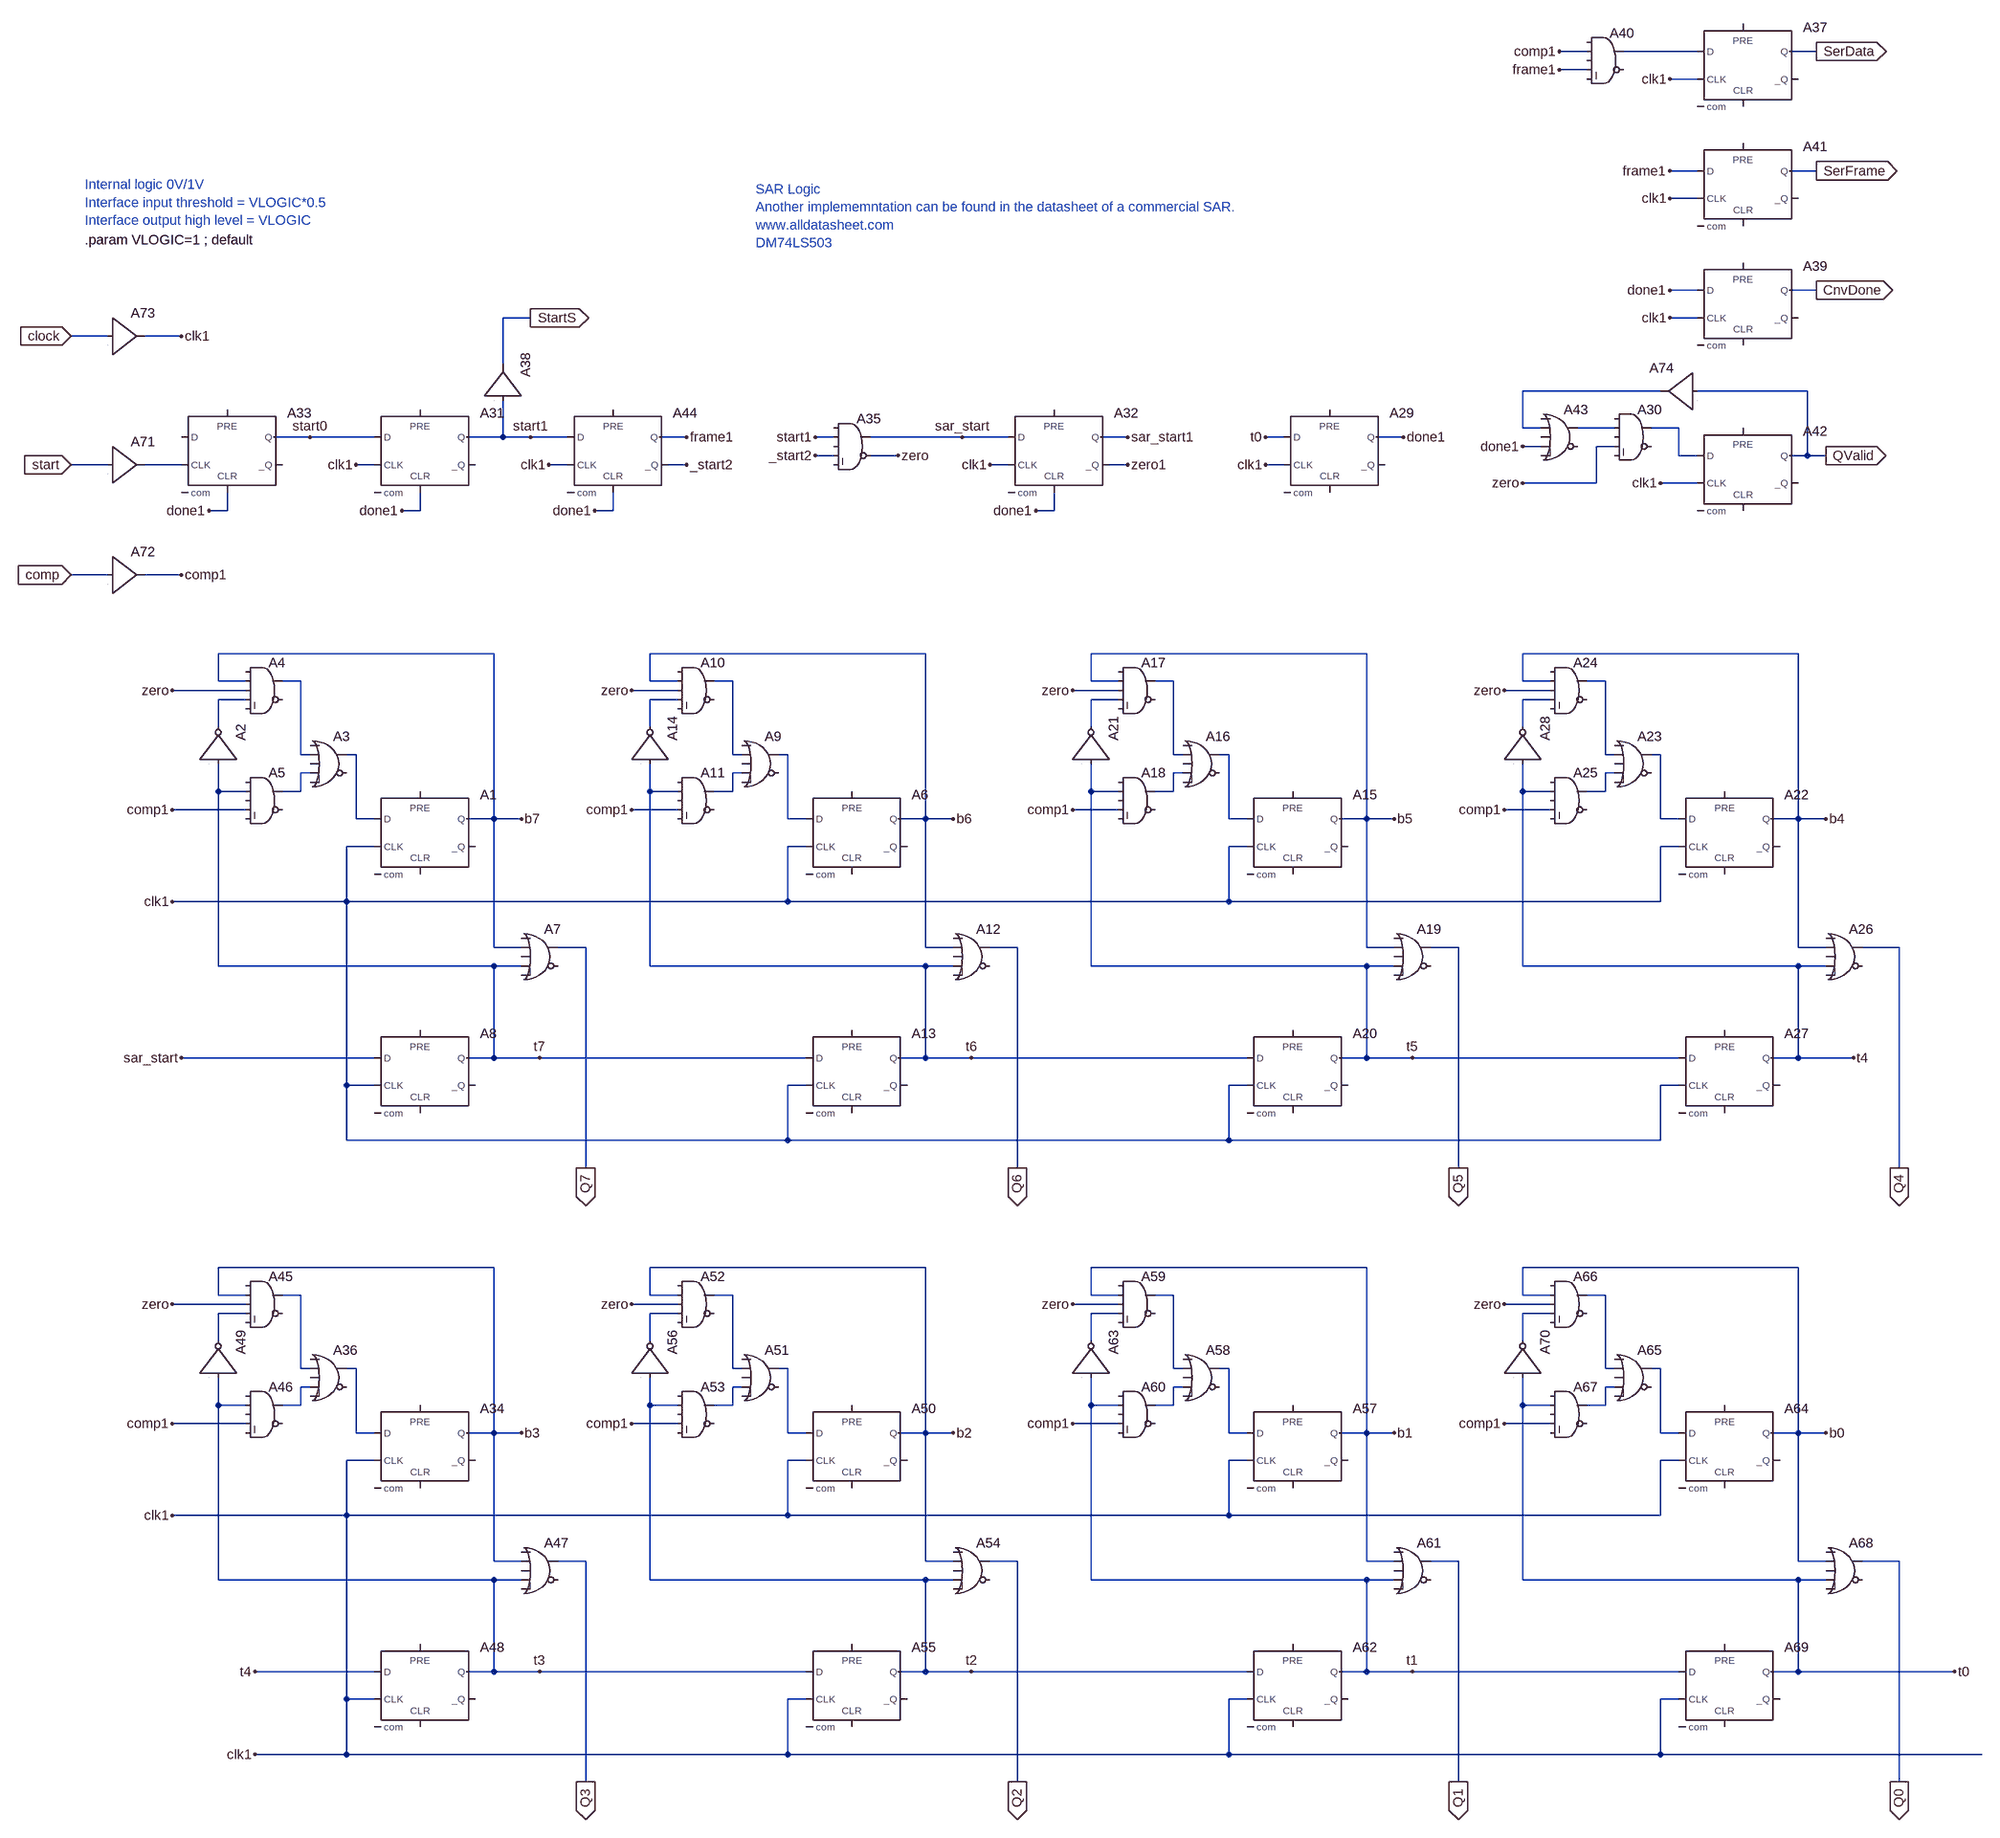
[diagram p0: schematic SAR8bit.asc]
SAR8bit.asc, the LTspice schematic file:
Version 4
SHEET 1 5864 2120
WIRE 1952 -1168 1904 -1168
WIRE 2144 -1168 2016 -1168
WIRE 2352 -1168 2304 -1168
WIRE 1952 -1136 1904 -1136
WIRE 2144 -1120 2096 -1120
WIRE 2144 -960 2096 -960
WIRE 2352 -960 2304 -960
WIRE 2144 -912 2096 -912
WIRE 2144 -752 2096 -752
WIRE 2352 -752 2304 -752
WIRE 112 -704 64 -704
WIRE 2144 -704 2096 -704
WIRE -624 -672 -688 -672
WIRE -496 -672 -560 -672
WIRE 64 -624 64 -704
WIRE 2080 -576 1840 -576
WIRE 2336 -576 2144 -576
WIRE 1840 -512 1840 -576
WIRE 1872 -512 1840 -512
WIRE 2000 -512 1936 -512
WIRE 2112 -512 2064 -512
WIRE -272 -496 -336 -496
WIRE -160 -496 -272 -496
WIRE 64 -496 64 -560
WIRE 64 -496 0 -496
WIRE 112 -496 64 -496
WIRE 176 -496 112 -496
WIRE 384 -496 336 -496
WIRE 640 -496 608 -496
WIRE 864 -496 704 -496
WIRE 944 -496 864 -496
WIRE 1152 -496 1104 -496
WIRE 1424 -496 1392 -496
WIRE 1632 -496 1584 -496
WIRE 1872 -480 1840 -480
WIRE 2000 -480 1968 -480
WIRE 640 -464 608 -464
WIRE 752 -464 704 -464
WIRE 2112 -464 2112 -512
WIRE 2144 -464 2112 -464
WIRE 2336 -464 2336 -576
WIRE 2336 -464 2304 -464
WIRE 2368 -464 2336 -464
WIRE -624 -448 -688 -448
WIRE -496 -448 -560 -448
WIRE -160 -448 -192 -448
WIRE 176 -448 144 -448
WIRE 384 -448 352 -448
WIRE 944 -448 912 -448
WIRE 1152 -448 1120 -448
WIRE 1424 -448 1392 -448
WIRE 1968 -416 1968 -480
WIRE 1968 -416 1840 -416
WIRE 2144 -416 2080 -416
WIRE -416 -368 -416 -400
WIRE -416 -368 -448 -368
WIRE -80 -368 -80 -400
WIRE -80 -368 -112 -368
WIRE 256 -368 256 -400
WIRE 256 -368 224 -368
WIRE 1024 -368 1024 -400
WIRE 1024 -368 992 -368
WIRE -624 -256 -688 -256
WIRE -496 -256 -560 -256
WIRE 48 -64 -432 -64
WIRE 800 -64 320 -64
WIRE 1568 -64 1088 -64
WIRE 2320 -64 1840 -64
WIRE -432 -16 -432 -64
WIRE -384 -16 -432 -16
WIRE -288 -16 -320 -16
WIRE 320 -16 320 -64
WIRE 368 -16 320 -16
WIRE 464 -16 432 -16
WIRE 1088 -16 1088 -64
WIRE 1136 -16 1088 -16
WIRE 1232 -16 1200 -16
WIRE 1840 -16 1840 -64
WIRE 1888 -16 1840 -16
WIRE 1984 -16 1952 -16
WIRE -384 0 -512 0
WIRE 368 0 288 0
WIRE 1136 0 1056 0
WIRE 1888 0 1808 0
WIRE -384 16 -432 16
WIRE 368 16 320 16
WIRE 1136 16 1088 16
WIRE 1888 16 1840 16
WIRE -432 64 -432 16
WIRE 320 64 320 16
WIRE 1088 64 1088 16
WIRE 1840 64 1840 16
WIRE -288 112 -288 -16
WIRE -272 112 -288 112
WIRE -192 112 -208 112
WIRE 464 112 464 -16
WIRE 480 112 464 112
WIRE 560 112 544 112
WIRE 1232 112 1232 -16
WIRE 1248 112 1232 112
WIRE 1328 112 1312 112
WIRE 1984 112 1984 -16
WIRE 2000 112 1984 112
WIRE 2080 112 2064 112
WIRE -272 144 -288 144
WIRE 480 144 464 144
WIRE 1248 144 1232 144
WIRE 2000 144 1984 144
WIRE -432 176 -432 128
WIRE -384 176 -432 176
WIRE -288 176 -288 144
WIRE -288 176 -320 176
WIRE 320 176 320 128
WIRE 368 176 320 176
WIRE 464 176 464 144
WIRE 464 176 432 176
WIRE 1088 176 1088 128
WIRE 1136 176 1088 176
WIRE 1232 176 1232 144
WIRE 1232 176 1200 176
WIRE 1840 176 1840 128
WIRE 1888 176 1840 176
WIRE 1984 176 1984 144
WIRE 1984 176 1952 176
WIRE -384 208 -512 208
WIRE 368 208 288 208
WIRE 1136 208 1056 208
WIRE 1888 208 1808 208
WIRE -192 224 -192 112
WIRE -160 224 -192 224
WIRE 48 224 48 -64
WIRE 48 224 0 224
WIRE 96 224 48 224
WIRE 560 224 560 112
WIRE 592 224 560 224
WIRE 800 224 800 -64
WIRE 800 224 752 224
WIRE 848 224 800 224
WIRE 1328 224 1328 112
WIRE 1360 224 1328 224
WIRE 1568 224 1568 -64
WIRE 1568 224 1520 224
WIRE 1616 224 1568 224
WIRE 2080 224 2080 112
WIRE 2112 224 2080 224
WIRE 2320 224 2320 -64
WIRE 2320 224 2272 224
WIRE 2368 224 2320 224
WIRE -160 272 -208 272
WIRE 592 272 560 272
WIRE 1360 272 1328 272
WIRE 2112 272 2080 272
WIRE -208 368 -208 272
WIRE -208 368 -512 368
WIRE 560 368 560 272
WIRE 560 368 -208 368
WIRE 1328 368 1328 272
WIRE 1328 368 560 368
WIRE 2080 368 2080 272
WIRE 2080 368 1328 368
WIRE 48 448 48 224
WIRE 96 448 48 448
WIRE 208 448 160 448
WIRE 800 448 800 224
WIRE 848 448 800 448
WIRE 960 448 912 448
WIRE 1568 448 1568 224
WIRE 1616 448 1568 448
WIRE 1728 448 1680 448
WIRE 2320 448 2320 224
WIRE 2368 448 2320 448
WIRE 2496 448 2432 448
WIRE -432 480 -432 176
WIRE 48 480 -432 480
WIRE 96 480 48 480
WIRE 320 480 320 176
WIRE 800 480 320 480
WIRE 848 480 800 480
WIRE 1088 480 1088 176
WIRE 1568 480 1088 480
WIRE 1616 480 1568 480
WIRE 1840 480 1840 176
WIRE 2320 480 1840 480
WIRE 2368 480 2320 480
WIRE -160 640 -496 640
WIRE 48 640 48 480
WIRE 48 640 0 640
WIRE 128 640 48 640
WIRE 592 640 128 640
WIRE 800 640 800 480
WIRE 800 640 752 640
WIRE 880 640 800 640
WIRE 1360 640 880 640
WIRE 1568 640 1568 480
WIRE 1568 640 1520 640
WIRE 1648 640 1568 640
WIRE 2112 640 1648 640
WIRE 2320 640 2320 480
WIRE 2320 640 2272 640
WIRE 2416 640 2320 640
WIRE -208 688 -208 368
WIRE -160 688 -208 688
WIRE 592 688 560 688
WIRE 1360 688 1328 688
WIRE 2112 688 2080 688
WIRE -208 784 -208 688
WIRE 560 784 560 688
WIRE 560 784 -208 784
WIRE 1328 784 1328 688
WIRE 1328 784 560 784
WIRE 2080 784 2080 688
WIRE 2080 784 1328 784
WIRE 208 832 208 448
WIRE 960 832 960 448
WIRE 1728 832 1728 448
WIRE 2496 832 2496 448
WIRE 48 1072 -432 1072
WIRE 800 1072 320 1072
WIRE 1568 1072 1088 1072
WIRE 2320 1072 1840 1072
WIRE -432 1120 -432 1072
WIRE -384 1120 -432 1120
WIRE -288 1120 -320 1120
WIRE 320 1120 320 1072
WIRE 368 1120 320 1120
WIRE 464 1120 432 1120
WIRE 1088 1120 1088 1072
WIRE 1136 1120 1088 1120
WIRE 1232 1120 1200 1120
WIRE 1840 1120 1840 1072
WIRE 1888 1120 1840 1120
WIRE 1984 1120 1952 1120
WIRE -384 1136 -512 1136
WIRE 368 1136 288 1136
WIRE 1136 1136 1056 1136
WIRE 1888 1136 1808 1136
WIRE -384 1152 -432 1152
WIRE 368 1152 320 1152
WIRE 1136 1152 1088 1152
WIRE 1888 1152 1840 1152
WIRE -432 1200 -432 1152
WIRE 320 1200 320 1152
WIRE 1088 1200 1088 1152
WIRE 1840 1200 1840 1152
WIRE -288 1248 -288 1120
WIRE -272 1248 -288 1248
WIRE -192 1248 -208 1248
WIRE 464 1248 464 1120
WIRE 480 1248 464 1248
WIRE 560 1248 544 1248
WIRE 1232 1248 1232 1120
WIRE 1248 1248 1232 1248
WIRE 1328 1248 1312 1248
WIRE 1984 1248 1984 1120
WIRE 2000 1248 1984 1248
WIRE 2080 1248 2064 1248
WIRE -272 1280 -288 1280
WIRE 480 1280 464 1280
WIRE 1248 1280 1232 1280
WIRE 2000 1280 1984 1280
WIRE -432 1312 -432 1264
WIRE -384 1312 -432 1312
WIRE -288 1312 -288 1280
WIRE -288 1312 -320 1312
WIRE 320 1312 320 1264
WIRE 368 1312 320 1312
WIRE 464 1312 464 1280
WIRE 464 1312 432 1312
WIRE 1088 1312 1088 1264
WIRE 1136 1312 1088 1312
WIRE 1232 1312 1232 1280
WIRE 1232 1312 1200 1312
WIRE 1840 1312 1840 1264
WIRE 1888 1312 1840 1312
WIRE 1984 1312 1984 1280
WIRE 1984 1312 1952 1312
WIRE -384 1344 -512 1344
WIRE 368 1344 288 1344
WIRE 1136 1344 1056 1344
WIRE 1888 1344 1808 1344
WIRE -192 1360 -192 1248
WIRE -160 1360 -192 1360
WIRE 48 1360 48 1072
WIRE 48 1360 0 1360
WIRE 96 1360 48 1360
WIRE 560 1360 560 1248
WIRE 592 1360 560 1360
WIRE 800 1360 800 1072
WIRE 800 1360 752 1360
WIRE 848 1360 800 1360
WIRE 1328 1360 1328 1248
WIRE 1360 1360 1328 1360
WIRE 1568 1360 1568 1072
WIRE 1568 1360 1520 1360
WIRE 1616 1360 1568 1360
WIRE 2080 1360 2080 1248
WIRE 2112 1360 2080 1360
WIRE 2320 1360 2320 1072
WIRE 2320 1360 2272 1360
WIRE 2368 1360 2320 1360
WIRE -160 1408 -208 1408
WIRE 592 1408 560 1408
WIRE 1360 1408 1328 1408
WIRE 2112 1408 2080 1408
WIRE -208 1504 -208 1408
WIRE -208 1504 -512 1504
WIRE 560 1504 560 1408
WIRE 560 1504 -208 1504
WIRE 1328 1504 1328 1408
WIRE 1328 1504 560 1504
WIRE 2080 1504 2080 1408
WIRE 2080 1504 1328 1504
WIRE 48 1584 48 1360
WIRE 96 1584 48 1584
WIRE 208 1584 160 1584
WIRE 800 1584 800 1360
WIRE 848 1584 800 1584
WIRE 960 1584 912 1584
WIRE 1568 1584 1568 1360
WIRE 1616 1584 1568 1584
WIRE 1728 1584 1680 1584
WIRE 2320 1584 2320 1360
WIRE 2368 1584 2320 1584
WIRE 2496 1584 2432 1584
WIRE -432 1616 -432 1312
WIRE 48 1616 -432 1616
WIRE 96 1616 48 1616
WIRE 320 1616 320 1312
WIRE 800 1616 320 1616
WIRE 848 1616 800 1616
WIRE 1088 1616 1088 1312
WIRE 1568 1616 1088 1616
WIRE 1616 1616 1568 1616
WIRE 1840 1616 1840 1312
WIRE 2320 1616 1840 1616
WIRE 2368 1616 2320 1616
WIRE -160 1776 -368 1776
WIRE 48 1776 48 1616
WIRE 48 1776 0 1776
WIRE 128 1776 48 1776
WIRE 592 1776 128 1776
WIRE 800 1776 800 1616
WIRE 800 1776 752 1776
WIRE 880 1776 800 1776
WIRE 1360 1776 880 1776
WIRE 1568 1776 1568 1616
WIRE 1568 1776 1520 1776
WIRE 1648 1776 1568 1776
WIRE 2112 1776 1648 1776
WIRE 2320 1776 2320 1616
WIRE 2320 1776 2272 1776
WIRE 2592 1776 2320 1776
WIRE -208 1824 -208 1504
WIRE -160 1824 -208 1824
WIRE 592 1824 560 1824
WIRE 1360 1824 1328 1824
WIRE 2112 1824 2080 1824
WIRE -208 1920 -208 1824
WIRE -208 1920 -368 1920
WIRE 560 1920 560 1824
WIRE 560 1920 -208 1920
WIRE 1328 1920 1328 1824
WIRE 1328 1920 560 1920
WIRE 2080 1920 2080 1824
WIRE 2080 1920 1328 1920
WIRE 2640 1920 2080 1920
WIRE 208 1968 208 1584
WIRE 960 1968 960 1584
WIRE 1728 1968 1728 1584
WIRE 2496 1968 2496 1584
FLAG -512 0 zero
FLAG -512 208 comp1
FLAG -496 640 sar_start
FLAG 1056 0 zero
FLAG 1056 208 comp1
FLAG 752 -464 zero
FLAG -512 368 clk1
FLAG -688 -448 start
IOPIN -688 -448 In
FLAG 208 832 Q7
IOPIN 208 832 Out
FLAG 960 832 Q6
IOPIN 960 832 Out
FLAG 1728 832 Q5
IOPIN 1728 832 Out
FLAG 288 208 comp1
FLAG 1808 208 comp1
FLAG 288 0 zero
FLAG 1808 0 zero
FLAG 2496 832 Q4
IOPIN 2496 832 Out
FLAG -448 -368 done1
FLAG 2352 -752 CnvDone
IOPIN 2352 -752 Out
FLAG 1392 -448 clk1
FLAG 1392 -496 t0
FLAG 864 -496 sar_start
FLAG 2352 -1168 SerData
IOPIN 2352 -1168 Out
FLAG 1904 -1168 comp1
FLAG 2096 -1120 clk1
FLAG 1904 -1136 frame1
FLAG 2352 -960 SerFrame
IOPIN 2352 -960 Out
FLAG 2096 -912 clk1
FLAG 2096 -960 frame1
FLAG 1632 -496 done1
FLAG 2096 -704 clk1
FLAG 2080 -416 clk1
FLAG 1840 -480 done1
FLAG 2368 -464 QValid
IOPIN 2368 -464 Out
FLAG 112 -704 StartS
IOPIN 112 -704 Out
FLAG 384 -448 _start2
FLAG 608 -496 start1
FLAG 608 -464 _start2
FLAG 384 -496 frame1
FLAG 1152 -496 sar_start1
FLAG 912 -448 clk1
FLAG 144 -448 clk1
FLAG -192 -448 clk1
FLAG 1152 -448 zero1
FLAG -112 -368 done1
FLAG 224 -368 done1
FLAG 992 -368 done1
FLAG 1840 -416 zero
FLAG 2096 -752 done1
FLAG 96 224 b7
FLAG 848 224 b6
FLAG 1616 224 b5
FLAG 2368 224 b4
FLAG 128 640 t7
FLAG 880 640 t6
FLAG 1648 640 t5
FLAG -512 1136 zero
FLAG -512 1344 comp1
FLAG 1056 1136 zero
FLAG 1056 1344 comp1
FLAG -512 1504 clk1
FLAG 208 1968 Q3
IOPIN 208 1968 Out
FLAG 960 1968 Q2
IOPIN 960 1968 Out
FLAG 1728 1968 Q1
IOPIN 1728 1968 Out
FLAG 288 1344 comp1
FLAG 1808 1344 comp1
FLAG 288 1136 zero
FLAG 1808 1136 zero
FLAG 2496 1968 Q0
IOPIN 2496 1968 Out
FLAG 2592 1776 t0
FLAG 96 1360 b3
FLAG 848 1360 b2
FLAG 1616 1360 b1
FLAG 2368 1360 b0
FLAG 128 1776 t3
FLAG 880 1776 t2
FLAG 1648 1776 t1
FLAG 2416 640 t4
FLAG -368 1776 t4
FLAG -368 1920 clk1
FLAG -272 -496 start0
FLAG 112 -496 start1
FLAG -688 -256 comp
IOPIN -688 -256 In
FLAG -496 -256 comp1
FLAG -688 -672 clock
IOPIN -688 -672 In
FLAG -496 -672 clk1
SYMBOL Digital\\dflop -80 176 R0
SYMATTR InstName A1
SYMATTR Value2 trise=5n td=5n tripdt=1n
SYMBOL Digital\\or -240 64 R0
SYMATTR InstName A3
SYMBOL Digital\\and -352 -64 R0
SYMATTR InstName A4
SYMBOL Digital\\and -352 128 R0
SYMATTR InstName A5
SYMBOL Digital\\or 128 400 R0
SYMATTR InstName A7
SYMATTR SpiceLine Vhigh={VLOGIC} REF=0.5
SYMBOL Digital\\dflop -80 592 R0
SYMATTR InstName A8
SYMATTR Value2 trise=5n td=5n tripdt=1n
SYMBOL Digital\\inv -368 128 M270
SYMATTR InstName A2
SYMBOL Digital\\dflop 672 176 R0
SYMATTR InstName A6
SYMATTR Value2 trise=5n td=5n tripdt=1n
SYMBOL Digital\\or 512 64 R0
SYMATTR InstName A9
SYMBOL Digital\\and 400 -64 R0
SYMATTR InstName A10
SYMBOL Digital\\and 400 128 R0
SYMATTR InstName A11
SYMBOL Digital\\or 880 400 R0
SYMATTR InstName A12
SYMATTR SpiceLine Vhigh={VLOGIC} REF=0.5
SYMBOL Digital\\dflop 672 592 R0
SYMATTR InstName A13
SYMATTR Value2 trise=5n td=5n tripdt=1n
SYMBOL Digital\\inv 384 128 M270
SYMATTR InstName A14
SYMBOL Digital\\dflop 1440 176 R0
SYMATTR InstName A15
SYMATTR Value2 trise=5n td=5n tripdt=1n
SYMBOL Digital\\or 1280 64 R0
SYMATTR InstName A16
SYMBOL Digital\\and 1168 -64 R0
SYMATTR InstName A17
SYMBOL Digital\\and 1168 128 R0
SYMATTR InstName A18
SYMBOL Digital\\or 1648 400 R0
SYMATTR InstName A19
SYMATTR SpiceLine Vhigh={VLOGIC} REF=0.5
SYMBOL Digital\\dflop 1440 592 R0
SYMATTR InstName A20
SYMATTR Value2 trise=5n td=5n tripdt=1n
SYMBOL Digital\\inv 1152 128 M270
SYMATTR InstName A21
SYMBOL Digital\\dflop 2192 176 R0
SYMATTR InstName A22
SYMATTR Value2 trise=5n td=5n tripdt=1n
SYMBOL Digital\\or 2032 64 R0
SYMATTR InstName A23
SYMBOL Digital\\and 1920 -64 R0
SYMATTR InstName A24
SYMBOL Digital\\and 1920 128 R0
SYMATTR InstName A25
SYMBOL Digital\\or 2400 400 R0
SYMATTR InstName A26
SYMATTR SpiceLine Vhigh={VLOGIC} REF=0.5
SYMBOL Digital\\dflop 2192 592 R0
SYMATTR InstName A27
SYMATTR Value2 trise=5n td=5n tripdt=1n
SYMBOL Digital\\inv 1904 128 M270
SYMATTR InstName A28
SYMBOL Digital\\dflop 1504 -544 R0
SYMATTR InstName A29
SYMATTR Value2 trise=5n td=5n tripdt=1n
SYMBOL Digital\\dflop -80 -544 R0
SYMATTR InstName A31
SYMATTR Value2 trise=5n td=5n tripdt=1n
SYMBOL Digital\\dflop -416 -544 R0
SYMATTR InstName A33
SYMATTR Value2 trise=5n td=5n tripdt=1n
SYMBOL Digital\\and 672 -544 R0
SYMATTR InstName A35
SYMBOL Digital\\dflop 2224 -800 R0
SYMATTR InstName A39
SYMATTR Value2 trise=5n td=5n tripdt=1n
SYMATTR SpiceLine Vhigh={VLOGIC} REF=0.5
SYMBOL Digital\\dflop 2224 -1216 R0
SYMATTR InstName A37
SYMATTR Value2 trise=5n td=5n tripdt=1n
SYMATTR SpiceLine Vhigh={VLOGIC} REF=0.5
SYMBOL Digital\\and 1984 -1216 R0
SYMATTR InstName A40
SYMBOL Digital\\dflop 2224 -1008 R0
SYMATTR InstName A41
SYMATTR Value2 trise=5n td=5n tripdt=1n
SYMATTR SpiceLine Vhigh={VLOGIC} REF=0.5
SYMBOL Digital\\dflop 2224 -512 R0
SYMATTR InstName A42
SYMATTR Value2 trise=5n td=5n tripdt=1n
SYMATTR SpiceLine Vhigh={VLOGIC} REF=0.5
SYMBOL Digital\\or 1904 -560 R0
SYMATTR InstName A43
SYMBOL Digital\\dflop 256 -544 R0
SYMATTR InstName A44
SYMATTR Value2 trise=5n td=5n tripdt=1n
SYMBOL Digital\\dflop 1024 -544 R0
SYMATTR InstName A32
SYMATTR Value2 trise=5n td=5n tripdt=1n
SYMBOL Digital\\and 2032 -560 R0
SYMATTR InstName A30
SYMBOL Digital\\dflop -80 1312 R0
SYMATTR InstName A34
SYMATTR Value2 trise=5n td=5n tripdt=1n
SYMBOL Digital\\or -240 1200 R0
SYMATTR InstName A36
SYMBOL Digital\\and -352 1072 R0
SYMATTR InstName A45
SYMBOL Digital\\and -352 1264 R0
SYMATTR InstName A46
SYMBOL Digital\\or 128 1536 R0
SYMATTR InstName A47
SYMATTR SpiceLine Vhigh={VLOGIC} REF=0.5
SYMBOL Digital\\dflop -80 1728 R0
SYMATTR InstName A48
SYMATTR Value2 trise=5n td=5n tripdt=1n
SYMBOL Digital\\inv -368 1264 M270
SYMATTR InstName A49
SYMBOL Digital\\dflop 672 1312 R0
SYMATTR InstName A50
SYMATTR Value2 trise=5n td=5n tripdt=1n
SYMBOL Digital\\or 512 1200 R0
SYMATTR InstName A51
SYMBOL Digital\\and 400 1072 R0
SYMATTR InstName A52
SYMBOL Digital\\and 400 1264 R0
SYMATTR InstName A53
SYMBOL Digital\\or 880 1536 R0
SYMATTR InstName A54
SYMATTR SpiceLine Vhigh={VLOGIC} REF=0.5
SYMBOL Digital\\dflop 672 1728 R0
SYMATTR InstName A55
SYMATTR Value2 trise=5n td=5n tripdt=1n
SYMBOL Digital\\inv 384 1264 M270
SYMATTR InstName A56
SYMBOL Digital\\dflop 1440 1312 R0
SYMATTR InstName A57
SYMATTR Value2 trise=5n td=5n tripdt=1n
SYMBOL Digital\\or 1280 1200 R0
SYMATTR InstName A58
SYMBOL Digital\\and 1168 1072 R0
SYMATTR InstName A59
SYMBOL Digital\\and 1168 1264 R0
SYMATTR InstName A60
SYMBOL Digital\\or 1648 1536 R0
SYMATTR InstName A61
SYMATTR SpiceLine Vhigh={VLOGIC} REF=0.5
SYMBOL Digital\\dflop 1440 1728 R0
SYMATTR InstName A62
SYMATTR Value2 trise=5n td=5n tripdt=1n
SYMBOL Digital\\inv 1152 1264 M270
SYMATTR InstName A63
SYMBOL Digital\\dflop 2192 1312 R0
SYMATTR InstName A64
SYMATTR Value2 trise=5n td=5n tripdt=1n
SYMBOL Digital\\or 2032 1200 R0
SYMATTR InstName A65
SYMBOL Digital\\and 1920 1072 R0
SYMATTR InstName A66
SYMBOL Digital\\and 1920 1264 R0
SYMATTR InstName A67
SYMBOL Digital\\or 2400 1536 R0
SYMATTR InstName A68
SYMATTR SpiceLine Vhigh={VLOGIC} REF=0.5
SYMBOL Digital\\dflop 2192 1728 R0
SYMATTR InstName A69
SYMATTR Value2 trise=5n td=5n tripdt=1n
SYMBOL Digital\\inv 1904 1264 M270
SYMATTR InstName A70
SYMBOL Digital\\buf1 128 -560 M270
SYMATTR InstName A38
SYMATTR SpiceLine Vhigh={VLOGIC} REF=0.5
SYMBOL Digital\\buf1 -624 -512 R0
SYMATTR InstName A71
SYMATTR SpiceLine Ref={VLOGIC*0.5}  VHIGH=1
SYMBOL Digital\\buf1 -624 -320 R0
SYMATTR InstName A72
SYMATTR SpiceLine Ref={VLOGIC*0.5}  VHIGH=1
SYMBOL Digital\\buf1 -624 -736 R0
SYMATTR InstName A73
SYMATTR SpiceLine Ref={VLOGIC*0.5}  VHIGH=1
SYMBOL Digital\\buf1 2144 -640 M0
SYMATTR InstName A74
SYMATTR SpiceLine Ref={VLOGIC*0.5} Vhigh=1
TEXT -664 -840 Left 0 !.param VLOGIC=1 ; default
TEXT -664 -936 Left 0 ;Internal logic 0V/1V\nInterface input threshold = VLOGIC*0.5\nInterface output high level = VLOGIC
TEXT 504 -928 Left 0 ;SAR Logic\nAnother implememntation can be found in the datasheet of a commercial SAR.\nwww.alldatasheet.com\nDM74LS503

The netlist it stands for:
* SAR8bit.asc
A1 N014 0 clk1 0 0 0 b7 0 DFLOP trise=5n td=5n tripdt=1n
A3 0 N006 0 N018 0 0 N014 0 OR
A4 0 b7 zero N010 0 0 N006 0 AND
A5 0 t7 0 comp1 0 0 N018 0 AND
A7 0 b7 0 t7 0 0 Q7 0 OR Vhigh={VLOGIC} REF=0.5
A8 sar_start 0 clk1 0 0 0 t7 0 DFLOP trise=5n td=5n tripdt=1n
A2 t7 0 0 0 0 N010 0 0 BUF
A6 N015 0 clk1 0 0 0 b6 0 DFLOP trise=5n td=5n tripdt=1n
A9 0 N007 0 N019 0 0 N015 0 OR
A10 0 b6 zero N011 0 0 N007 0 AND
A11 0 t6 0 comp1 0 0 N019 0 AND
A12 0 b6 0 t6 0 0 Q6 0 OR Vhigh={VLOGIC} REF=0.5
A13 t7 0 clk1 0 0 0 t6 0 DFLOP trise=5n td=5n tripdt=1n
A14 t6 0 0 0 0 N011 0 0 BUF
A15 N016 0 clk1 0 0 0 b5 0 DFLOP trise=5n td=5n tripdt=1n
A16 0 N008 0 N020 0 0 N016 0 OR
A17 0 b5 zero N012 0 0 N008 0 AND
A18 0 t5 0 comp1 0 0 N020 0 AND
A19 0 b5 0 t5 0 0 Q5 0 OR Vhigh={VLOGIC} REF=0.5
A20 t6 0 clk1 0 0 0 t5 0 DFLOP trise=5n td=5n tripdt=1n
A21 t5 0 0 0 0 N012 0 0 BUF
A22 N017 0 clk1 0 0 0 b4 0 DFLOP trise=5n td=5n tripdt=1n
A23 0 N009 0 N021 0 0 N017 0 OR
A24 0 b4 zero N013 0 0 N009 0 AND
A25 0 t4 0 comp1 0 0 N021 0 AND
A26 0 b4 0 t4 0 0 Q4 0 OR Vhigh={VLOGIC} REF=0.5
A27 t5 0 clk1 0 0 0 t4 0 DFLOP trise=5n td=5n tripdt=1n
A28 t4 0 0 0 0 N013 0 0 BUF
A29 t0 0 clk1 0 0 0 done1 0 DFLOP trise=5n td=5n tripdt=1n
A31 start0 0 clk1 0 done1 0 start1 0 DFLOP trise=5n td=5n tripdt=1n
A33 0 0 N005 0 done1 0 start0 0 DFLOP trise=5n td=5n tripdt=1n
A35 0 start1 0 _start2 0 zero sar_start 0 AND
A39 done1 0 clk1 0 0 0 CnvDone 0 DFLOP trise=5n td=5n tripdt=1n Vhigh={VLOGIC} REF=0.5
A37 N001 0 clk1 0 0 0 SerData 0 DFLOP trise=5n td=5n tripdt=1n Vhigh={VLOGIC} REF=0.5
A40 0 comp1 0 frame1 0 0 N001 0 AND
A41 frame1 0 clk1 0 0 0 SerFrame 0 DFLOP trise=5n td=5n tripdt=1n Vhigh={VLOGIC} REF=0.5
A42 N004 0 clk1 0 0 0 QValid 0 DFLOP trise=5n td=5n tripdt=1n Vhigh={VLOGIC} REF=0.5
A43 0 N002 0 done1 0 0 N003 0 OR
A44 start1 0 clk1 0 done1 _start2 frame1 0 DFLOP trise=5n td=5n tripdt=1n
A32 sar_start 0 clk1 0 done1 zero1 sar_start1 0 DFLOP trise=5n td=5n tripdt=1n
A30 0 N003 0 zero 0 0 N004 0 AND
A34 N030 0 clk1 0 0 0 b3 0 DFLOP trise=5n td=5n tripdt=1n
A36 0 N022 0 N034 0 0 N030 0 OR
A45 0 b3 zero N026 0 0 N022 0 AND
A46 0 t3 0 comp1 0 0 N034 0 AND
A47 0 b3 0 t3 0 0 Q3 0 OR Vhigh={VLOGIC} REF=0.5
A48 t4 0 clk1 0 0 0 t3 0 DFLOP trise=5n td=5n tripdt=1n
A49 t3 0 0 0 0 N026 0 0 BUF
A50 N031 0 clk1 0 0 0 b2 0 DFLOP trise=5n td=5n tripdt=1n
A51 0 N023 0 N035 0 0 N031 0 OR
A52 0 b2 zero N027 0 0 N023 0 AND
A53 0 t2 0 comp1 0 0 N035 0 AND
A54 0 b2 0 t2 0 0 Q2 0 OR Vhigh={VLOGIC} REF=0.5
A55 t3 0 clk1 0 0 0 t2 0 DFLOP trise=5n td=5n tripdt=1n
A56 t2 0 0 0 0 N027 0 0 BUF
A57 N032 0 clk1 0 0 0 b1 0 DFLOP trise=5n td=5n tripdt=1n
A58 0 N024 0 N036 0 0 N032 0 OR
A59 0 b1 zero N028 0 0 N024 0 AND
A60 0 t1 0 comp1 0 0 N036 0 AND
A61 0 b1 0 t1 0 0 Q1 0 OR Vhigh={VLOGIC} REF=0.5
A62 t2 0 clk1 0 0 0 t1 0 DFLOP trise=5n td=5n tripdt=1n
A63 t1 0 0 0 0 N028 0 0 BUF
A64 N033 0 clk1 0 0 0 b0 0 DFLOP trise=5n td=5n tripdt=1n
A65 0 N025 0 N037 0 0 N033 0 OR
A66 0 b0 zero N029 0 0 N025 0 AND
A67 0 t0 0 comp1 0 0 N037 0 AND
A68 0 b0 0 t0 0 0 Q0 0 OR Vhigh={VLOGIC} REF=0.5
A69 t1 0 clk1 0 0 0 t0 0 DFLOP trise=5n td=5n tripdt=1n
A70 t0 0 0 0 0 N029 0 0 BUF
A38 start1 0 0 0 0 0 StartS 0 BUF Vhigh={VLOGIC} REF=0.5
A71 start 0 0 0 0 0 N005 0 BUF Ref={VLOGIC*0.5}  VHIGH=1
A72 comp 0 0 0 0 0 comp1 0 BUF Ref={VLOGIC*0.5}  VHIGH=1
A73 clock 0 0 0 0 0 clk1 0 BUF Ref={VLOGIC*0.5}  VHIGH=1
A74 QValid 0 0 0 0 0 N002 0 BUF Ref={VLOGIC*0.5} Vhigh=1
.param VLOGIC=1 ; default
* Internal logic 0V/1V
* Interface input threshold = VLOGIC*0.5
* Interface output high level = VLOGIC
* SAR Logic
* Another implememntation can be found in the datasheet of a commercial SAR.
* www.alldatasheet.com
* DM74LS503
.backanno
.end